# EAGLE schematic NN22_VCCS_SrcAdapter02_s00 (EAGLE 7.7.0)

## Sheet 1 of 4
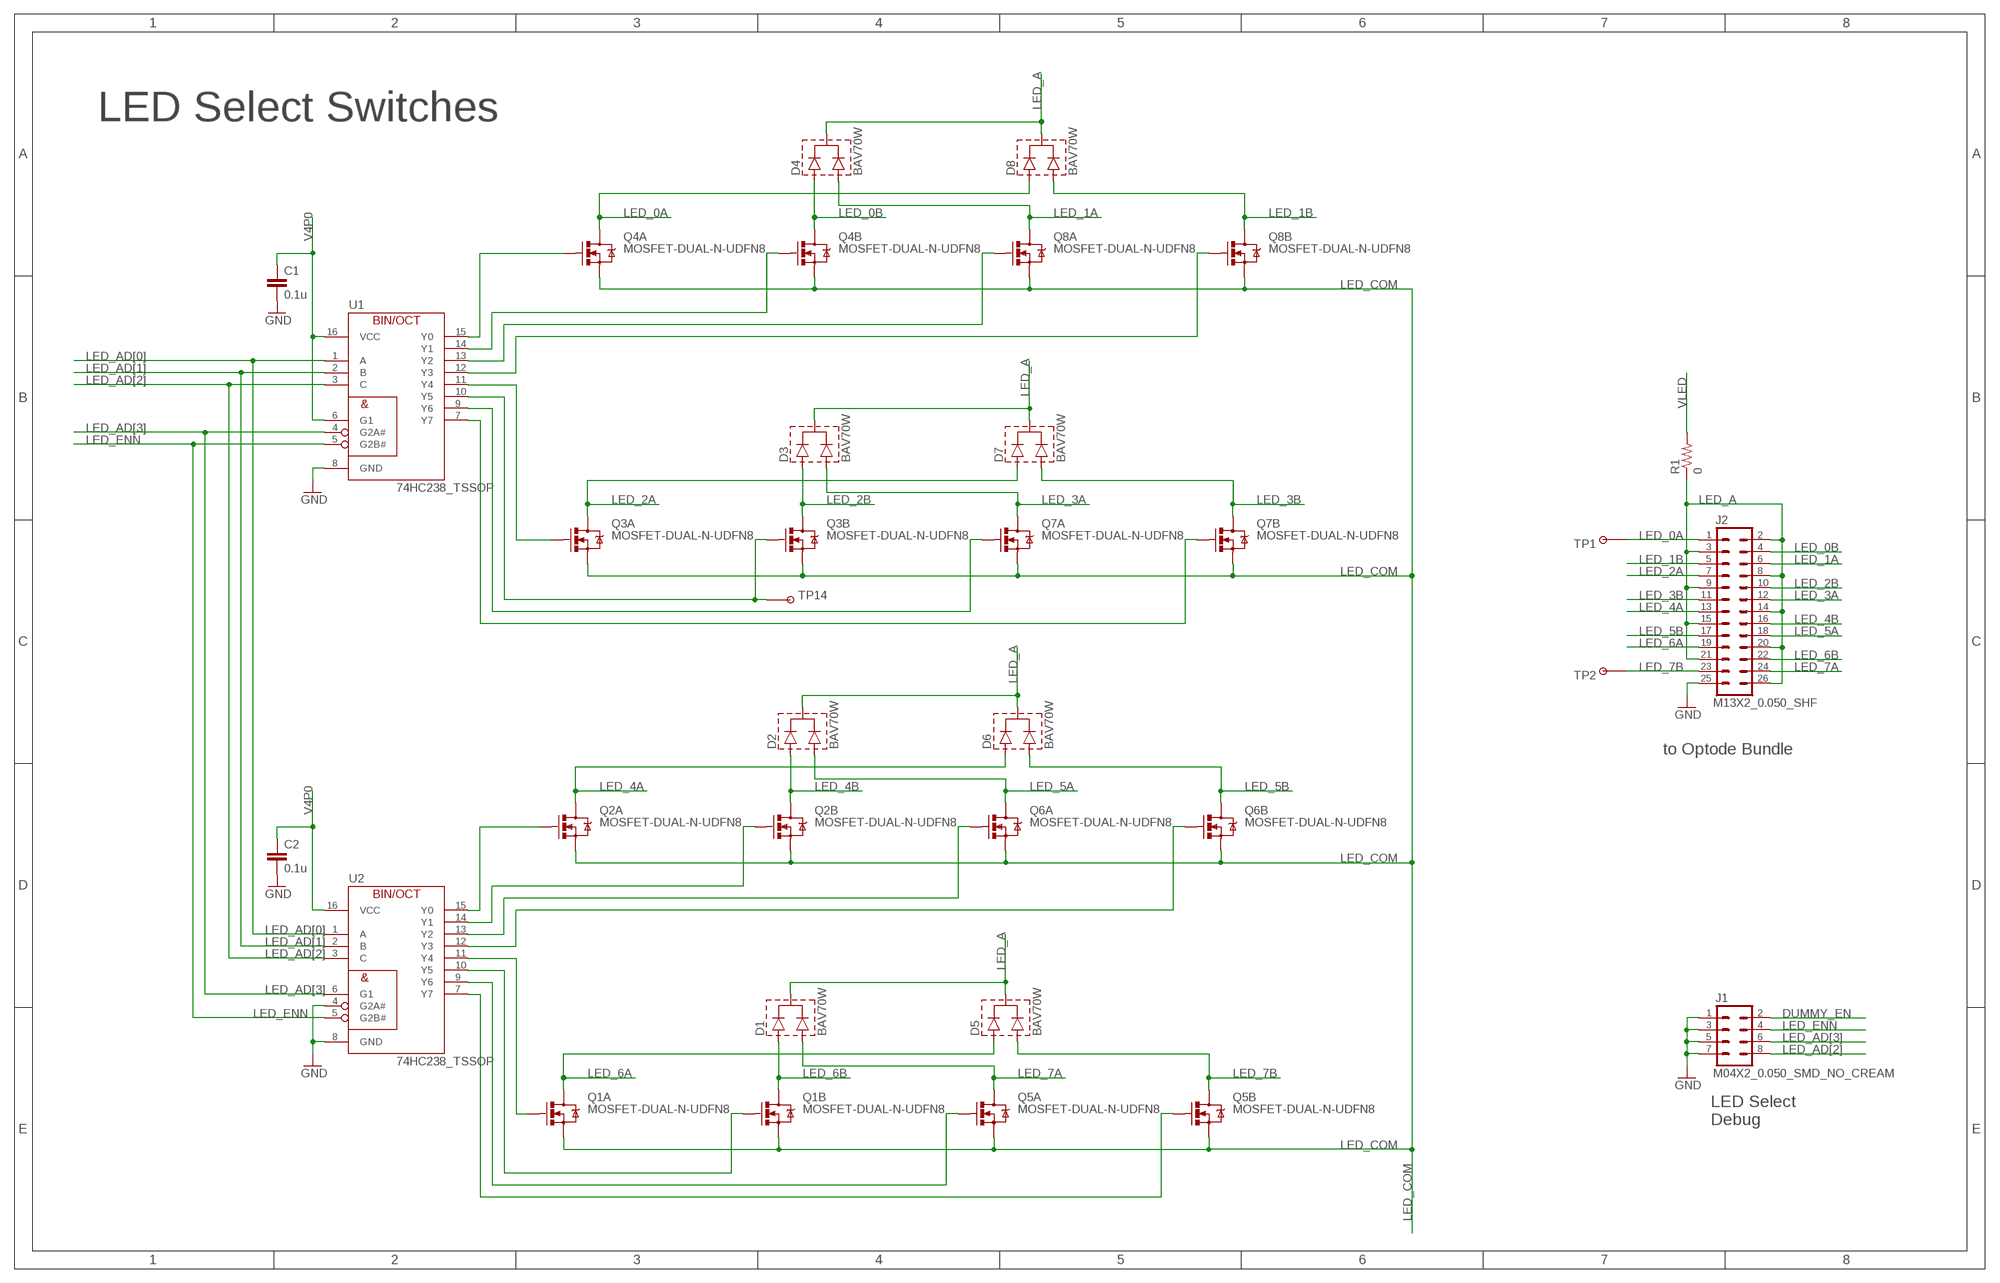
[diagram p0: schematic, sheet 1]

### Parts
C1  0.1u  CAP0402-CAP  [0402-CAP]
C2  0.1u  CAP0402-CAP  [0402-CAP]
D1  BAV70W  DIODE-COMMON_CATHODE_SOT323  [SOT323]
D2  BAV70W  DIODE-COMMON_CATHODE_SOT323  [SOT323]
D3  BAV70W  DIODE-COMMON_CATHODE_SOT323  [SOT323]
D4  BAV70W  DIODE-COMMON_CATHODE_SOT323  [SOT323]
D5  BAV70W  DIODE-COMMON_CATHODE_SOT323  [SOT323]
D6  BAV70W  DIODE-COMMON_CATHODE_SOT323  [SOT323]
D7  BAV70W  DIODE-COMMON_CATHODE_SOT323  [SOT323]
D8  BAV70W  DIODE-COMMON_CATHODE_SOT323  [SOT323]
J1  M04X2_0.050_SMD_NO_CREAM  [M04X2_0.050_SMD_NO_CREAM]
J2  M13X2_0.050_SHF  [M13X2_0.050_SHF]
Q1  MOSFET-DUAL-N-UDFN8  [UDFN8]
Q2  MOSFET-DUAL-N-UDFN8  [UDFN8]
Q3  MOSFET-DUAL-N-UDFN8  [UDFN8]
Q4  MOSFET-DUAL-N-UDFN8  [UDFN8]
Q5  MOSFET-DUAL-N-UDFN8  [UDFN8]
Q6  MOSFET-DUAL-N-UDFN8  [UDFN8]
Q7  MOSFET-DUAL-N-UDFN8  [UDFN8]
Q8  MOSFET-DUAL-N-UDFN8  [UDFN8]
R1  0  RESISTOR1206  [1206]
TP1  TESTPOINT_ROUND  [TESTPAD_ROUND]
TP2  TESTPOINT_ROUND  [TESTPAD_ROUND]
TP14  TESTPOINTPADSMALL  [TESTPAD_SMALL]
U1  74HC238_TSSOP  [TSSOP16]
U2  74HC238_TSSOP  [TSSOP16]

### Nets
DUMMY_EN: J1.2 ; also sheet 2,3
GND: C1.2 C2.2 J1.1 J1.3 J1.5 J1.7 J2.25 U1.8(GND) U2.4(G2A#) U2.8(GND) ; also sheet 2,3,4
LED_0A: D8.1(A1) J2.1 Q4.6(A:D) Q4.P1(A:D) TP1.P$1
LED_0B: D4.1(A1) J2.4 Q4.3(B:D) Q4.P2(B:D)
LED_1A: D4.2(A2) J2.6 Q8.6(A:D) Q8.P1(A:D)
LED_1B: D8.2(A2) J2.5 Q8.3(B:D) Q8.P2(B:D)
LED_2A: D7.1(A1) J2.7 Q3.6(A:D) Q3.P1(A:D)
LED_2B: D3.1(A1) J2.10 Q3.3(B:D) Q3.P2(B:D)
LED_3A: D3.2(A2) J2.12 Q7.6(A:D) Q7.P1(A:D)
LED_3B: D7.2(A2) J2.11 Q7.3(B:D) Q7.P2(B:D)
LED_4A: D6.1(A1) J2.13 Q2.6(A:D) Q2.P1(A:D)
LED_4B: D2.1(A1) J2.16 Q2.3(B:D) Q2.P2(B:D)
LED_5A: D2.2(A2) J2.18 Q6.6(A:D) Q6.P1(A:D)
LED_5B: D6.2(A2) J2.17 Q6.3(B:D) Q6.P2(B:D)
LED_6A: D5.1(A1) J2.19 Q1.6(A:D) Q1.P1(A:D)
LED_6B: D1.1(A1) J2.22 Q1.3(B:D) Q1.P2(B:D)
LED_7A: D1.2(A2) J2.24 Q5.6(A:D) Q5.P1(A:D)
LED_7B: D5.2(A2) J2.23 Q5.3(B:D) Q5.P2(B:D) TP2.P$1
LED_A: D1.3(C) D2.3(C) D3.3(C) D4.3(C) D5.3(C) D6.3(C) D7.3(C) D8.3(C) J2.2 J2.3 J2.8 J2.9 J2.14 J2.15 J2.20 J2.21 J2.26 R1.1
LED_AD[0]: U1.1(A) U2.1(A) ; also sheet 3
LED_AD[1]: U1.2(B) U2.2(B) ; also sheet 3
LED_AD[2]: J1.8 U1.3(C) U2.3(C) ; also sheet 3
LED_AD[3]: J1.6 U1.4(G2A#) U2.6(G1) ; also sheet 3
LED_COM: Q1.1(A:S) Q1.4(B:S) Q2.1(A:S) Q2.4(B:S) Q3.1(A:S) Q3.4(B:S) Q4.1(A:S) Q4.4(B:S) Q5.1(A:S) Q5.4(B:S) Q6.1(A:S) Q6.4(B:S) Q7.1(A:S) Q7.4(B:S) Q8.1(A:S) Q8.4(B:S) ; also sheet 2
LED_ENN: J1.4 U1.5(G2B#) U2.5(G2B#) ; also sheet 3
N$3: Q4.5(B:G) U1.14(Y1)
N$4: Q3.5(B:G) TP14.P$1 U1.10(Y5)
N$5: Q8.5(B:G) U1.12(Y3)
N$6: Q8.2(A:G) U1.13(Y2)
N$8: Q7.5(B:G) U1.7(Y7)
N$9: Q7.2(A:G) U1.9(Y6)
N$11: Q2.5(B:G) U2.14(Y1)
N$12: Q6.5(B:G) U2.12(Y3)
N$13: Q6.2(A:G) U2.13(Y2)
N$15: Q1.5(B:G) U2.10(Y5)
N$19: Q5.5(B:G) U2.7(Y7)
N$20: Q5.2(A:G) U2.9(Y6)
N$21: Q4.2(A:G) U1.15(Y0)
N$28: Q3.2(A:G) U1.11(Y4)
N$31: Q2.2(A:G) U2.15(Y0)
N$42: Q1.2(A:G) U2.11(Y4)
V4P0: C1.1 C2.1 U1.6(G1) U1.16(VCC) U2.16(VCC) ; also sheet 2,4
VLED: R1.2 ; also sheet 2,4

### Notes on the sheet
- LED Select Switches
- to Optode Bundle
- LED Select
  Debug

## Sheet 2 of 4
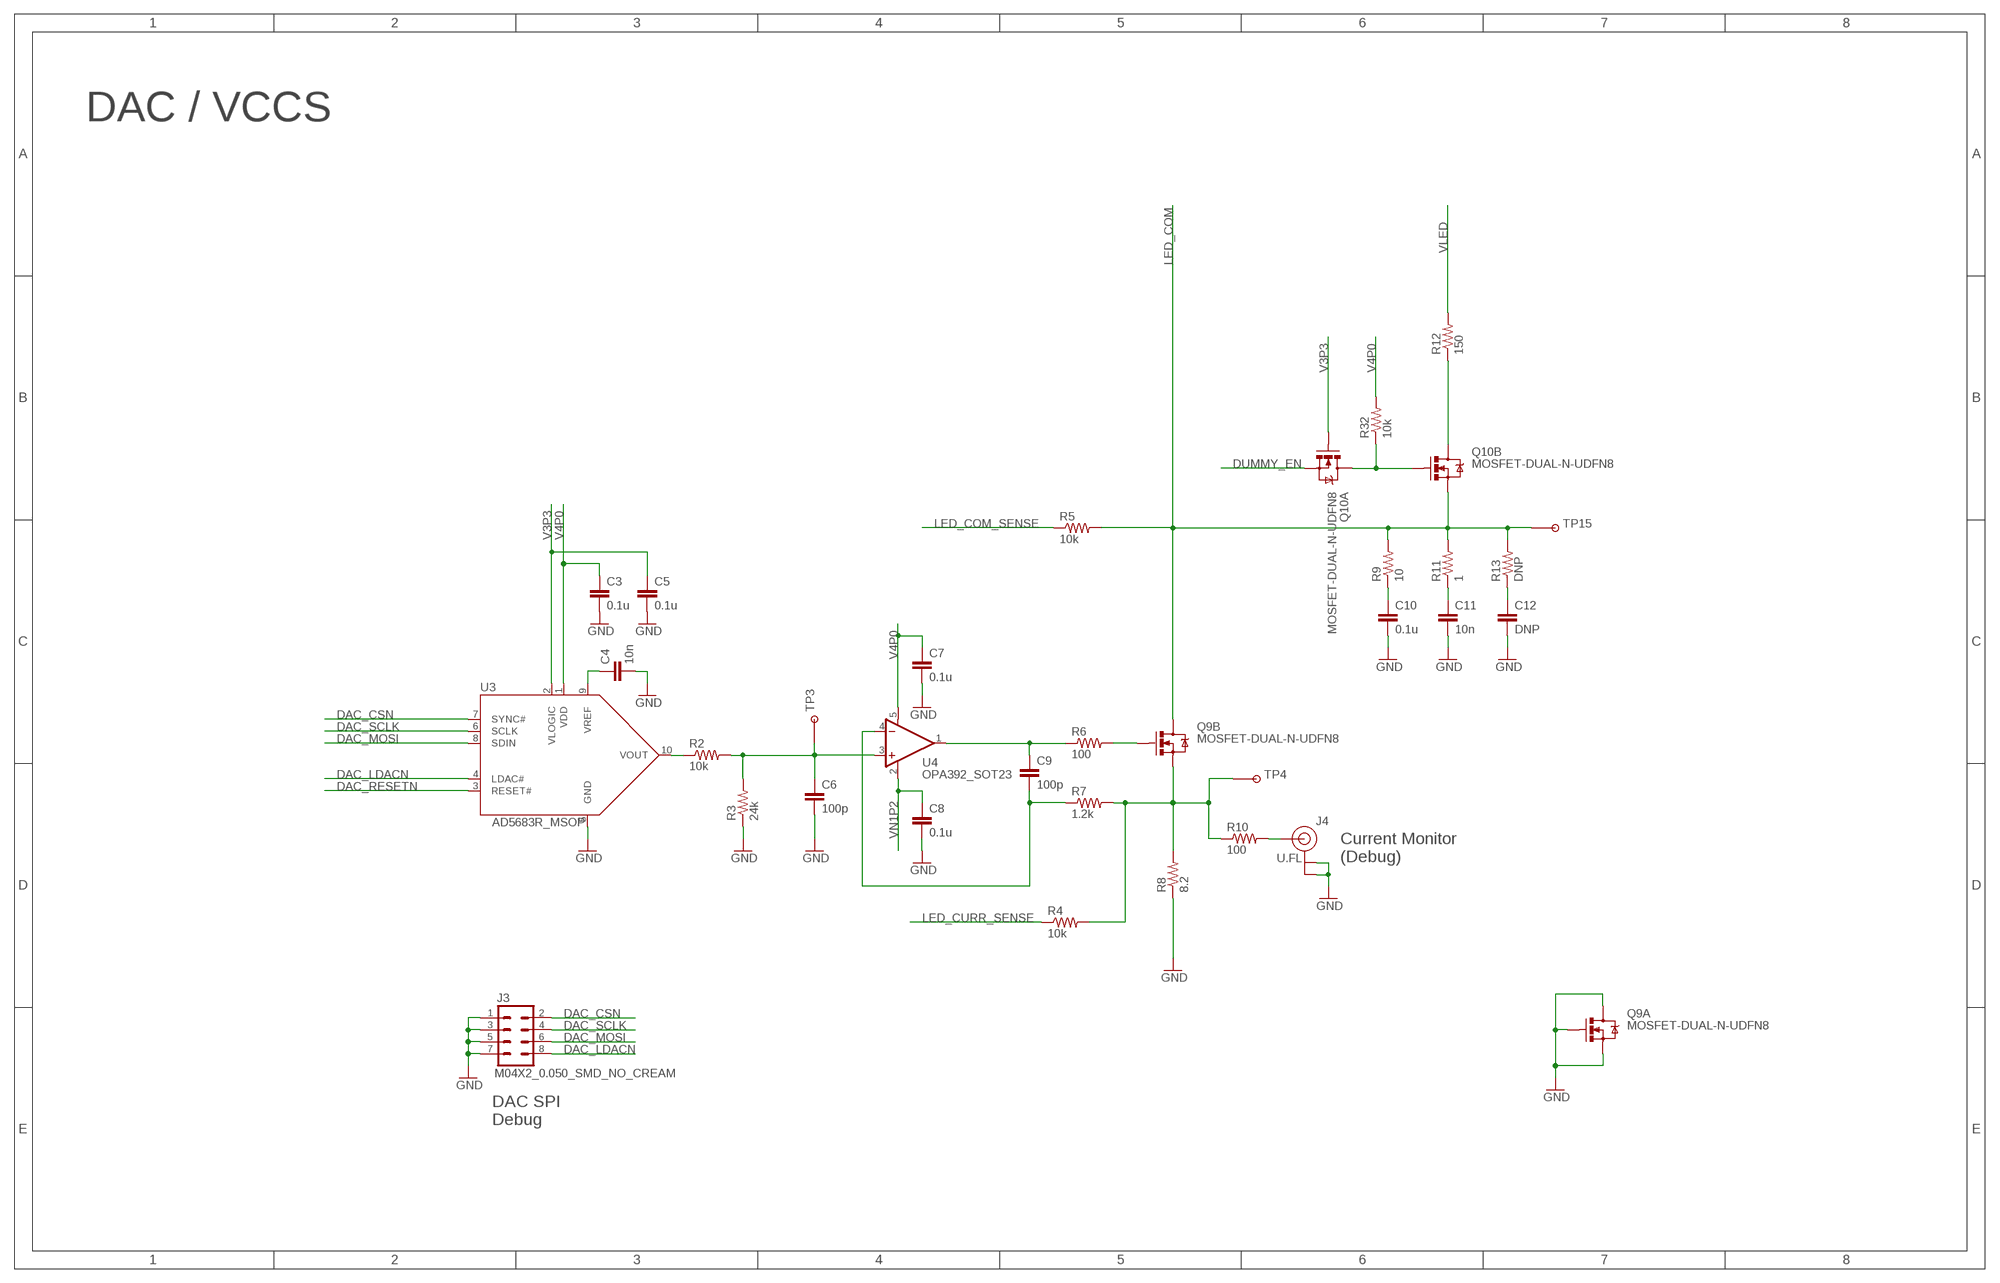
[diagram p1: schematic, sheet 2]

### Parts
C3  0.1u  CAP0402-CAP  [0402-CAP]
C4  10n  CAP0402-CAP  [0402-CAP]
C5  0.1u  CAP0402-CAP  [0402-CAP]
C6  100p  CAP0402-CAP  [0402-CAP]
C7  0.1u  CAP0402-CAP  [0402-CAP]
C8  0.1u  CAP0402-CAP  [0402-CAP]
C9  100p  CAP0402-CAP  [0402-CAP]
C10  0.1u  CAP0402-CAP  [0402-CAP]
C11  10n  CAP0402-CAP  [0402-CAP]
C12  DNP  CAP0603-CAP  [0603-CAP]
J3  M04X2_0.050_SMD_NO_CREAM  [M04X2_0.050_SMD_NO_CREAM]
J4  U.FL  [U.FL]
Q9  MOSFET-DUAL-N-UDFN8  [UDFN8]
Q10  MOSFET-DUAL-N-UDFN8  [UDFN8]
R2  10k  RESISTOR0402-RES  [0402-RES]
R3  24k  RESISTOR0402-RES  [0402-RES]
R4  10k  RESISTOR0402-RES  [0402-RES]
R5  10k  RESISTOR0402-RES  [0402-RES]
R6  100  RESISTOR0402-RES  [0402-RES]
R7  1.2k  RESISTOR0402-RES  [0402-RES]
R8  8.2  RESISTOR2512  [R2512]
R9  10  RESISTOR0603-RES  [0603-RES]
R10  100  RESISTOR0402-RES  [0402-RES]
R11  1  RESISTOR0603-RES  [0603-RES]
R12  150  RESISTOR0603-RES  [0603-RES]
R13  DNP  RESISTOR0603-RES  [0603-RES]
R32  10k  RESISTOR0402-RES  [0402-RES]
TP3  TESTPOINT_ROUND  [TESTPAD_ROUND]
TP4  TESTPOINT_ROUND  [TESTPAD_ROUND]
TP15  TESTPOINT_ROUND  [TESTPAD_ROUND]
U3  AD5683R_MSOP  [MSOP10]
U4  OPA392_SOT23  [SOT23-5]

### Nets
DAC_CSN: J3.2 U3.7(SYNC#) ; also sheet 3
DAC_LDACN: J3.8 U3.4(LDAC#) ; also sheet 3
DAC_MOSI: J3.6 U3.8(SDIN) ; also sheet 3
DAC_RESETN: U3.3(RESET#) ; also sheet 3
DAC_SCLK: J3.4 U3.6(SCLK) ; also sheet 3
DUMMY_EN: Q10.1(A:S) ; also sheet 1,3
GND: C3.2 C4.2 C5.2 C6.2 C7.2 C8.2 C10.2 C11.2 C12.2 J3.1 J3.3 J3.5 J3.7 J4.P$1(GND) J4.P$2(GND) Q9.1(A:S) Q9.2(A:G) Q9.6(A:D) Q9.P1(A:D) R3.1 R8.1 U3.5(GND) ; also sheet 1,3,4
LED_COM: Q9.3(B:D) Q9.P2(B:D) Q10.4(B:S) R5.2 R9.2 R11.2 R13.2 TP15.P$1 ; also sheet 1
LED_COM_SENSE: R5.1 ; also sheet 3
LED_CURR_SENSE: R4.1 ; also sheet 3
N$1: Q9.5(B:G) R6.2
N$2: R2.1 U3.10(VOUT)
N$7: Q10.3(B:D) Q10.P2(B:D) R12.1
N$10: C6.1 R2.2 R3.2 TP3.P$1 U4.3(+IN)
N$14: C9.1 R6.1 U4.1(OUT)
N$24: Q10.5(B:G) Q10.6(A:D) Q10.P1(A:D) R32.1
N$25: Q9.4(B:S) R4.2 R7.2 R8.2 R10.1 TP4.P$1
N$26: C9.2 R7.1 U4.4(-IN)
N$27: C4.1 U3.9(VREF)
N$32: J4.P$3(SIGNAL) R10.2
N$39: C11.1 R11.1
N$40: C10.1 R9.1
N$41: C12.1 R13.1
V3P3: C5.1 Q10.2(A:G) U3.2(VLOGIC) ; also sheet 3,4
V4P0: C3.1 C7.1 R32.2 U3.1(VDD) U4.5(V+) ; also sheet 1,4
VLED: R12.2 ; also sheet 1,4
VN1P2: C8.1 U4.2(V-) ; also sheet 4

### Notes on the sheet
- DAC / VCCS
- Current Monitor
  (Debug)
- DAC SPI
  Debug

## Sheet 3 of 4
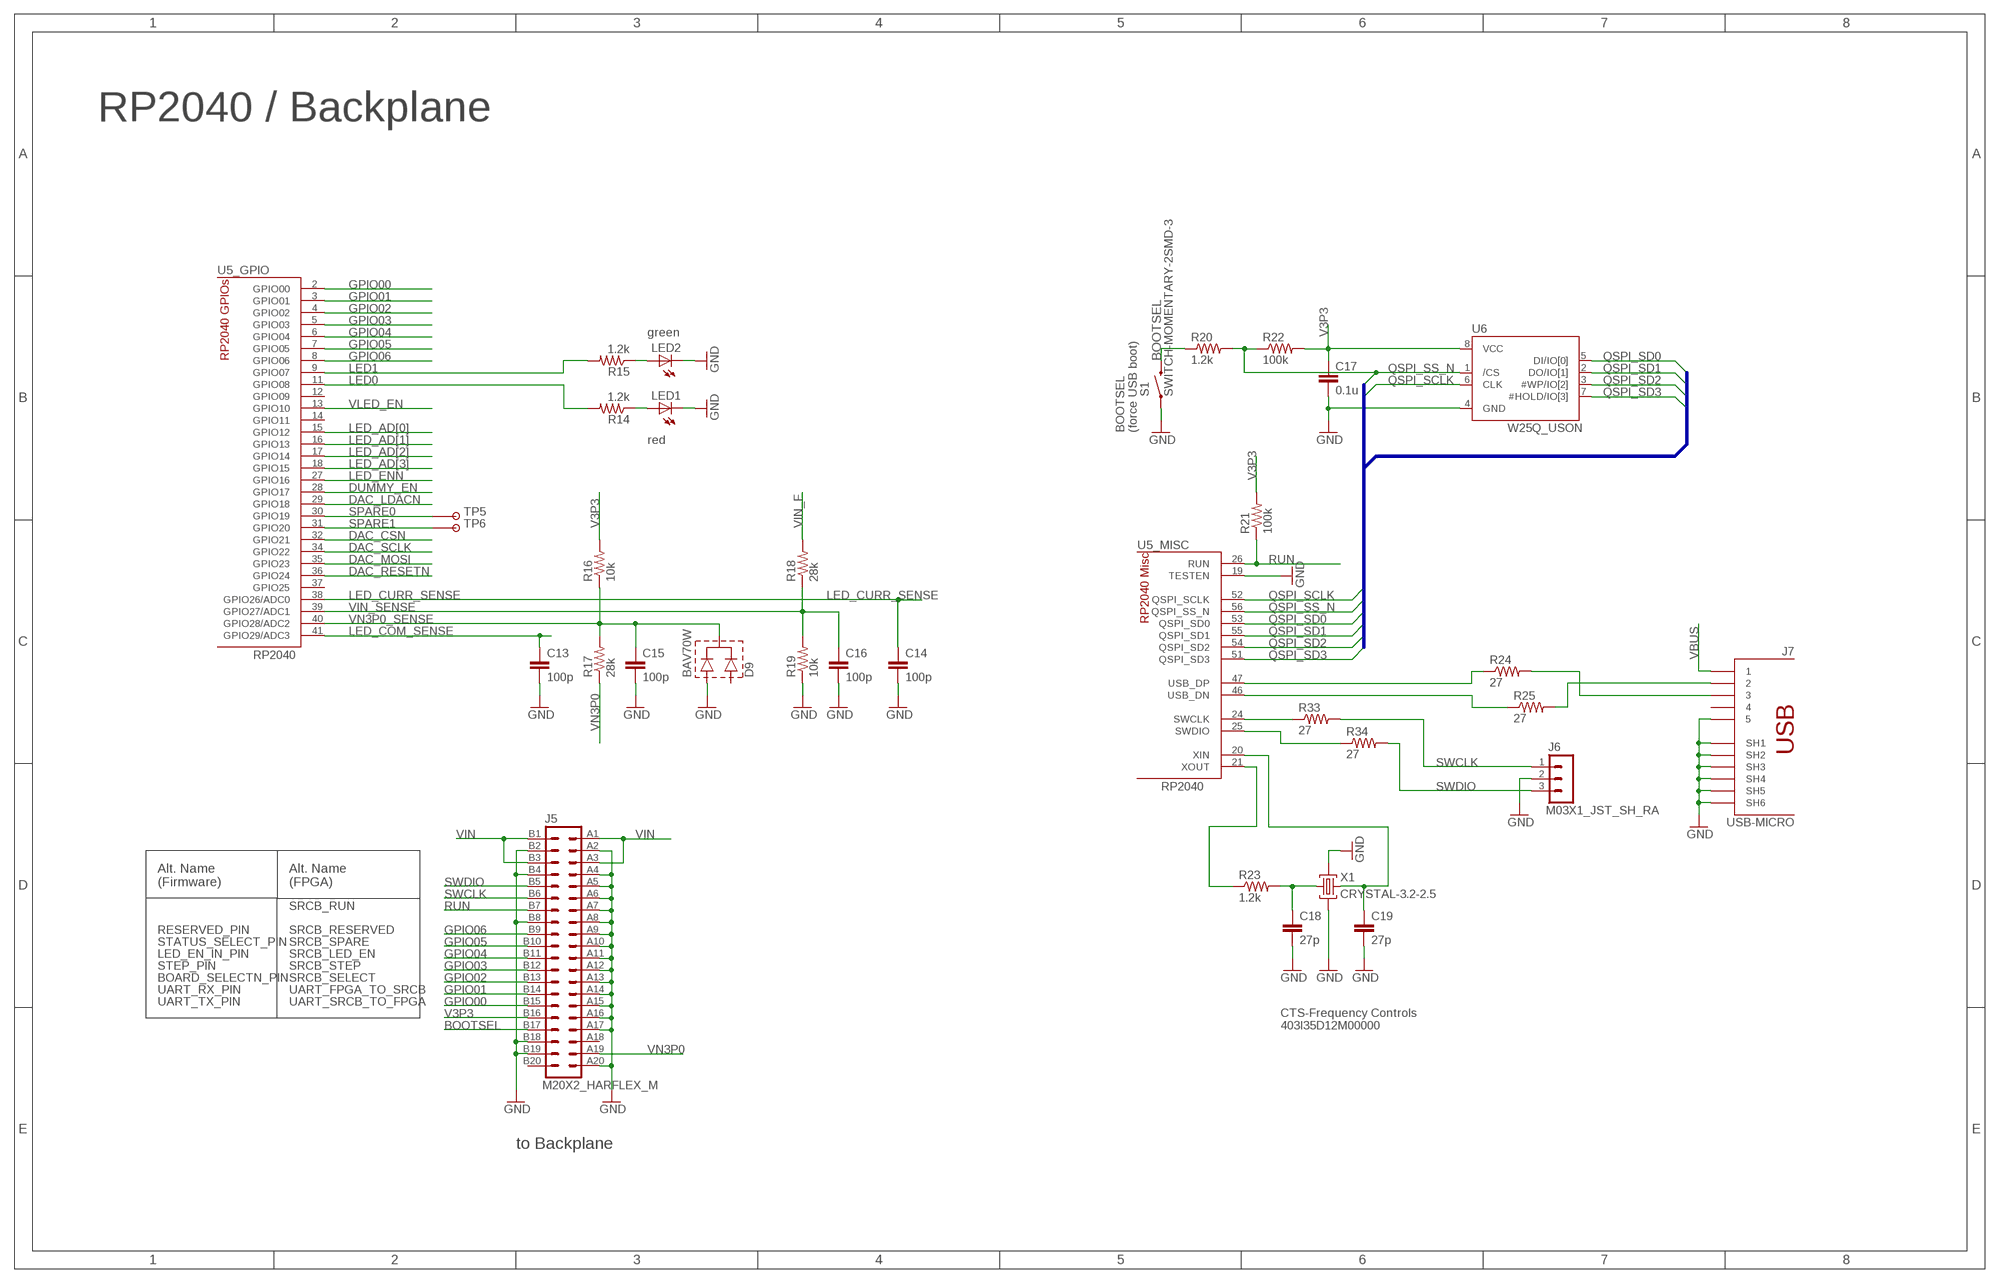
[diagram p2: schematic, sheet 3]

### Parts
C13  100p  CAP0402-CAP  [0402-CAP]
C14  100p  CAP0402-CAP  [0402-CAP]
C15  100p  CAP0402-CAP  [0402-CAP]
C16  100p  CAP0402-CAP  [0402-CAP]
C17  0.1u  CAP0402-CAP  [0402-CAP]
C18  27p  CAP0402-CAP  [0402-CAP]
C19  27p  CAP0402-CAP  [0402-CAP]
D9  BAV70W  DIODE-COMMON_CATHODE_SOT323  [SOT323]
J5  M20X2_HARFLEX_M  [M20X2_HARFLEX_M]
J6  M03X1_JST_SH_RA  [M03X1_JST_SH_SM_RA]
J7  USB-MICRO  [USB-MICRO]
LED1  LED0603  [LED-0603]
LED2  LED0603  [LED-0603]
R14  1.2k  RESISTOR0402-RES  [0402-RES]
R15  1.2k  RESISTOR0402-RES  [0402-RES]
R16  10k  RESISTOR0402-RES  [0402-RES]
R17  28k  RESISTOR0402-RES  [0402-RES]
R18  28k  RESISTOR0402-RES  [0402-RES]
R19  10k  RESISTOR0402-RES  [0402-RES]
R20  1.2k  RESISTOR0402-RES  [0402-RES]
R21  100k  RESISTOR0402-RES  [0402-RES]
R22  100k  RESISTOR0402-RES  [0402-RES]
R23  1.2k  RESISTOR0402-RES  [0402-RES]
R24  27  RESISTOR0402-RES  [0402-RES]
R25  27  RESISTOR0402-RES  [0402-RES]
R33  27  RESISTOR0402-RES  [0402-RES]
R34  27  RESISTOR0402-RES  [0402-RES]
S1  SWITCH-MOMENTARY-2SMD-3  [TACTILE_SWITCH_SMD-3]
TP5  TESTPOINTPADSMALL  [TESTPAD_SMALL]
TP6  TESTPOINTPADSMALL  [TESTPAD_SMALL]
U5  RP2040  [QFN-56_EP]
U6  W25Q_USON  [USON8L-2X3MM]
X1  CRYSTAL-3.2-2.5  [CRYSTAL-3.2-2.5]

### Nets
BOOTSEL: J5.B17 R20.1 S1.4
DAC_CSN: U5.32(_GPIO:GPIO21) ; also sheet 2
DAC_LDACN: U5.29(_GPIO:GPIO18) ; also sheet 2
DAC_MOSI: U5.35(_GPIO:GPIO23) ; also sheet 2
DAC_RESETN: U5.36(_GPIO:GPIO24) ; also sheet 2
DAC_SCLK: U5.34(_GPIO:GPIO22) ; also sheet 2
DUMMY_EN: U5.28(_GPIO:GPIO17) ; also sheet 1,2
GND: C13.2 C14.2 C15.2 C16.2 C17.2 C18.2 C19.2 D9.2(A2) J5.A2 J5.A4 J5.A5 J5.A6 J5.A7 J5.A8 J5.A9 J5.A10 J5.A11 J5.A12 J5.A13 J5.A14 J5.A15 J5.A16 J5.A17 J5.A20 J5.B2 J5.B4 J5.B8 J5.B18 J5.B19 J6.2 J7.5 J7.SH1 J7.SH2 J7.SH3 J7.SH4 J7.SH5 J7.SH6 LED1.C LED2.C R19.1 S1.1 U5.19(_MISC:TESTEN) U6.4(GND) X1.2(GND) X1.4(GND) ; also sheet 1,2,4
GPIO00: J5.B15 U5.2(_GPIO:GPIO00)
GPIO01: J5.B14 U5.3(_GPIO:GPIO01)
GPIO02: J5.B13 U5.4(_GPIO:GPIO02)
GPIO03: J5.B12 U5.5(_GPIO:GPIO03)
GPIO04: J5.B11 U5.6(_GPIO:GPIO04)
GPIO05: J5.B10 U5.7(_GPIO:GPIO05)
GPIO06: J5.B9 U5.8(_GPIO:GPIO06)
LED0: R14.2 U5.11(_GPIO:GPIO08)
LED1: R15.2 U5.9(_GPIO:GPIO07)
LED_AD[0]: U5.15(_GPIO:GPIO12) ; also sheet 1
LED_AD[1]: U5.16(_GPIO:GPIO13) ; also sheet 1
LED_AD[2]: U5.17(_GPIO:GPIO14) ; also sheet 1
LED_AD[3]: U5.18(_GPIO:GPIO15) ; also sheet 1
LED_COM_SENSE: C13.1 U5.41(_GPIO:GPIO29/ADC3) ; also sheet 2
LED_CURR_SENSE: C14.1 U5.38(_GPIO:GPIO26/ADC0) ; also sheet 2
LED_ENN: U5.27(_GPIO:GPIO16) ; also sheet 1
N$16: C19.1 U5.20(_MISC:XIN) X1.3(C2)
N$17: C18.1 R23.2 X1.1(C1)
N$18: R23.1 U5.21(_MISC:XOUT)
N$29: R24.1 U5.47(_MISC:USB_DP)
N$30: R25.1 U5.46(_MISC:USB_DN)
N$33: R34.1 U5.25(_MISC:SWDIO)
N$34: R33.1 U5.24(_MISC:SWCLK)
N$35: J7.2 R25.2
N$37: J7.3 R24.2
N$46: LED1.A R14.1
N$109: LED2.A R15.1
QSPI_SCLK: U5.52(_MISC:QSPI_SCLK) U6.6(CLK)
QSPI_SD0: U5.53(_MISC:QSPI_SD0) U6.5(DI/IO[0])
QSPI_SD1: U5.55(_MISC:QSPI_SD1) U6.2(DO/IO[1])
QSPI_SD2: U5.54(_MISC:QSPI_SD2) U6.3(#WP/IO[2])
QSPI_SD3: U5.51(_MISC:QSPI_SD3) U6.7(#HOLD/IO[3])
QSPI_SS_N: R20.2 R22.1 U5.56(_MISC:QSPI_SS_N) U6.1(/CS)
RUN: J5.B7 R21.1 U5.26(_MISC:RUN)
SPARE0: TP5.P$1 U5.30(_GPIO:GPIO19)
SPARE1: TP6.P$1 U5.31(_GPIO:GPIO20)
SWCLK: J5.B6 J6.1 R33.2
SWDIO: J5.B5 J6.3 R34.2
V3P3: C17.1 J5.B16 R16.2 R21.2 R22.2 U6.8(VCC) ; also sheet 2,4
VBUS: J7.1 ; also sheet 4
VIN: J5.A1 J5.A3 J5.B1 J5.B3 ; also sheet 4
VIN_F: R18.2 ; also sheet 4
VIN_SENSE: C16.1 R18.1 R19.2 U5.39(_GPIO:GPIO27/ADC1)
VLED_EN: U5.13(_GPIO:GPIO10) ; also sheet 4
VN3P0: J5.A19 R17.1 ; also sheet 4
VN3P0_SENSE: C15.1 D9.3(C) R16.1 R17.2 U5.40(_GPIO:GPIO28/ADC2)
Unconnected: D9.1(A1) J5.A18 J5.B20 J7.4 U5.12(_GPIO:GPIO09) U5.14(_GPIO:GPIO11) U5.37(_GPIO:GPIO25)

### Buses
QSPI_SCLK,QSPI_SS_N,QSPI_SD[0..3]

### Notes on the sheet
- RP2040 / Backplane
- green
- BOOTSEL
  (force USB boot)
- red
- Alt. Name
  (Firmware)
- Alt. Name
  (FPGA)
- SRCB_RUN
- RESERVED_PIN | SRCB_RESERVED
- STATUS_SELECT_PIN | SRCB_SPARE
- LED_EN_IN_PIN | SRCB_LED_EN
- STEP_PIN | SRCB_STEP
- BOARD_SELECTN_PIN | SRCB_SELECT
- UART_RX_PIN | UART_FPGA_TO_SRCB
- UART_TX_PIN | UART_SRCB_TO_FPGA
- CTS-Frequency Controls
  403I35D12M00000
- to Backplane

## Sheet 4 of 4
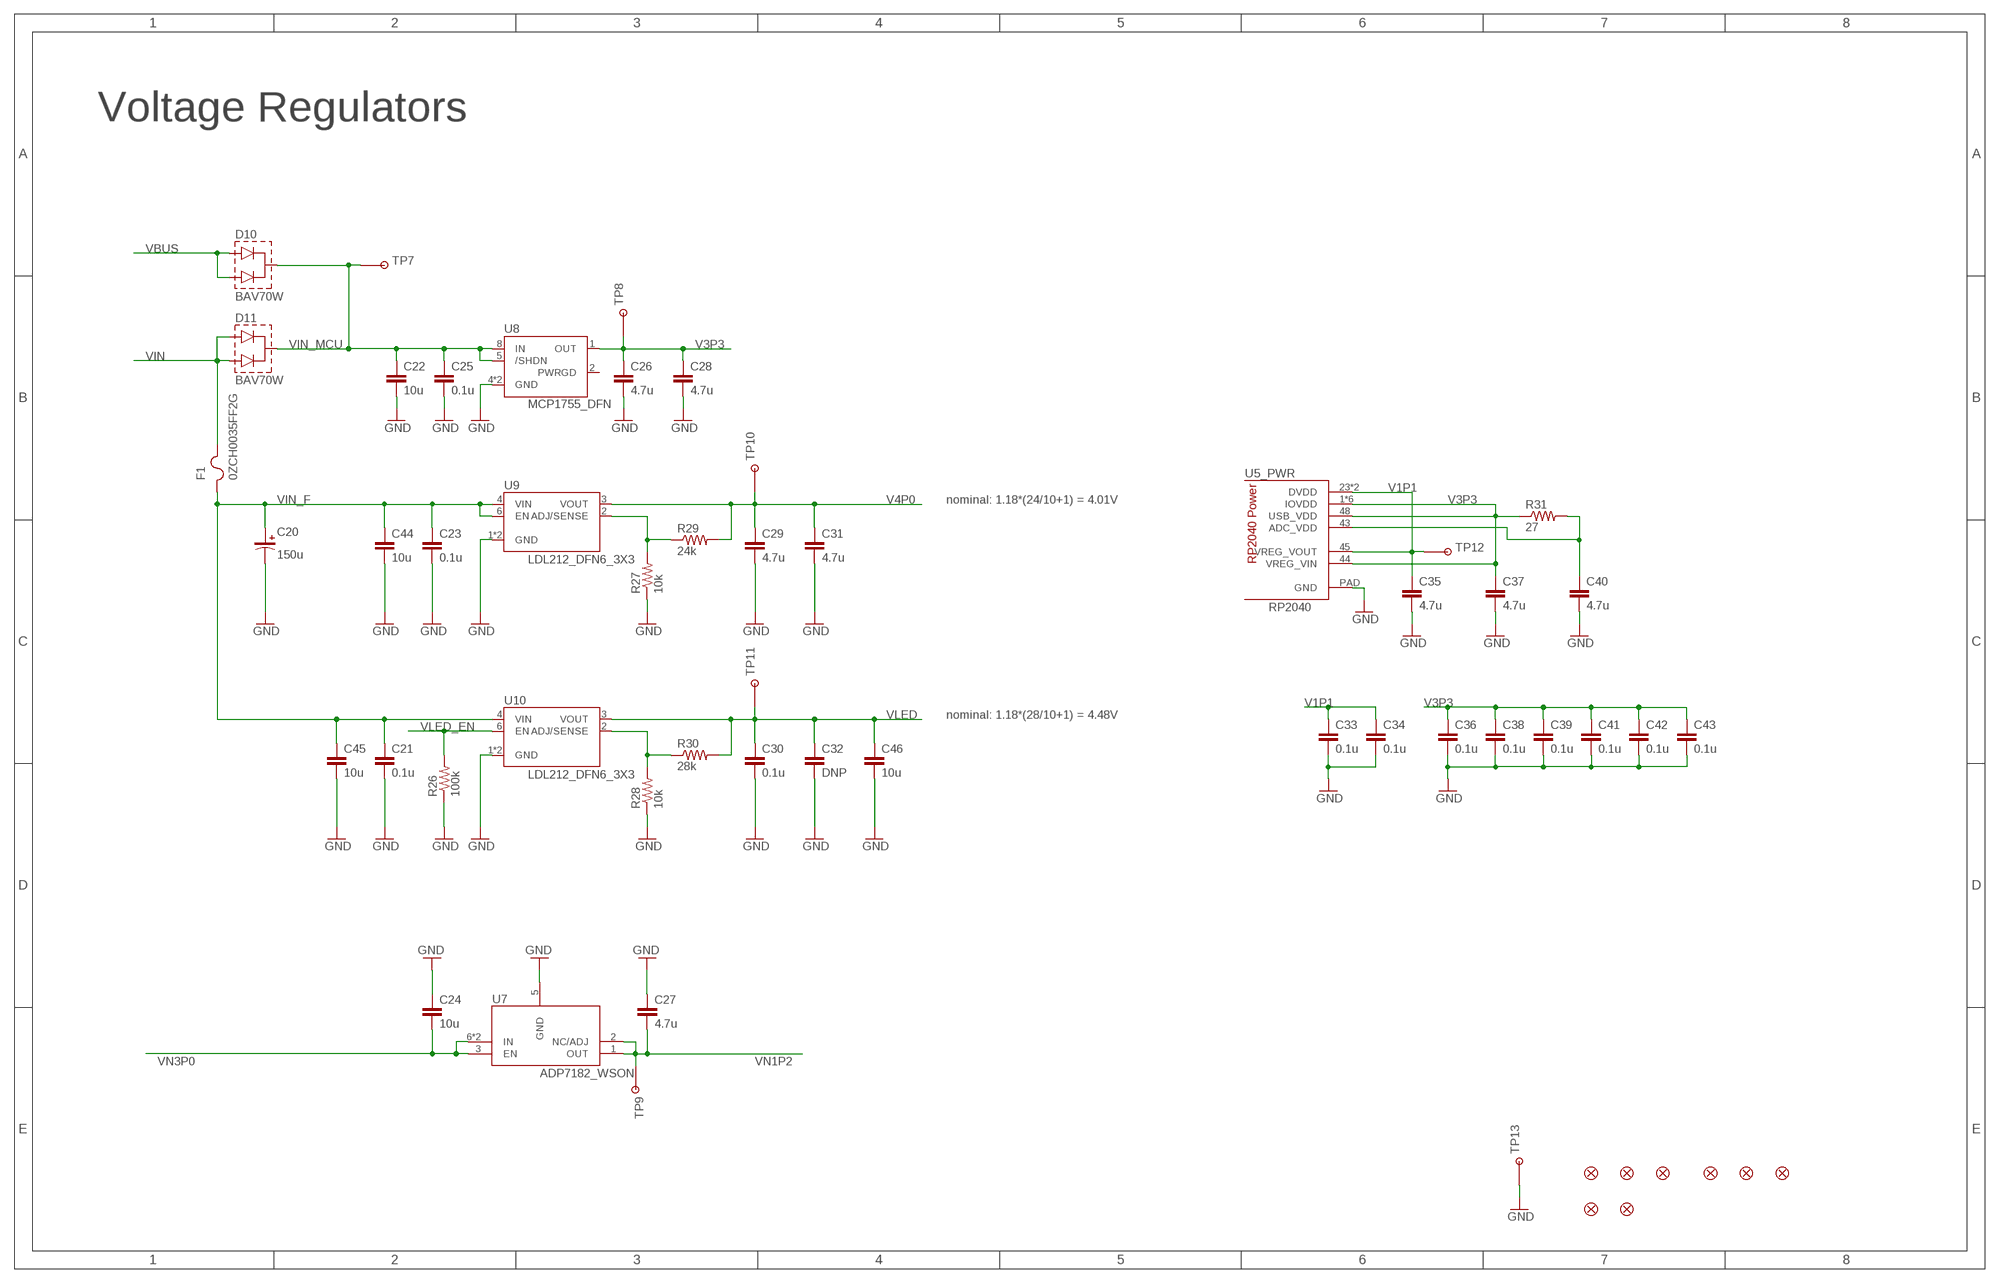
[diagram p3: schematic, sheet 4]

### Parts
C20  150u  CAP-POL2917  [2917-CAP]
C21  0.1u  CAP0402-CAP  [0402-CAP]
C22  10u  CAP0603-CAP  [0603-CAP]
C23  0.1u  CAP0402-CAP  [0402-CAP]
C24  10u  CAP0603-CAP  [0603-CAP]
C25  0.1u  CAP0402-CAP  [0402-CAP]
C26  4.7u  CAP0402-CAP  [0402-CAP]
C27  4.7u  CAP0402-CAP  [0402-CAP]
C28  4.7u  CAP0402-CAP  [0402-CAP]
C29  4.7u  CAP0402-CAP  [0402-CAP]
C30  0.1u  CAP0402-CAP  [0402-CAP]
C31  4.7u  CAP0402-CAP  [0402-CAP]
C32  DNP  CAP0402-CAP  [0402-CAP]
C33  0.1u  CAP0402-CAP  [0402-CAP]
C34  0.1u  CAP0402-CAP  [0402-CAP]
C35  4.7u  CAP0402-CAP  [0402-CAP]
C36  0.1u  CAP0402-CAP  [0402-CAP]
C37  4.7u  CAP0402-CAP  [0402-CAP]
C38  0.1u  CAP0402-CAP  [0402-CAP]
C39  0.1u  CAP0402-CAP  [0402-CAP]
C40  4.7u  CAP0402-CAP  [0402-CAP]
C41  0.1u  CAP0402-CAP  [0402-CAP]
C42  0.1u  CAP0402-CAP  [0402-CAP]
C43  0.1u  CAP0402-CAP  [0402-CAP]
C44  10u  CAP0603-CAP  [0603-CAP]
C45  10u  CAP0603-CAP  [0603-CAP]
C46  10u  CAP0603-CAP  [0603-CAP]
D10  BAV70W  DIODE-COMMON_CATHODE_SOT323  [SOT323]
D11  BAV70W  DIODE-COMMON_CATHODE_SOT323  [SOT323]
F1  0ZCH0035FF2G  FUSE_1210  [1210-FUSE]
FID1  FIDUCIALUFIDUCIAL  [MICRO-FIDUCIAL]
FID2  FIDUCIALUFIDUCIAL  [MICRO-FIDUCIAL]
FID3  FIDUCIALUFIDUCIAL  [MICRO-FIDUCIAL]
FID4  FIDUCIALUFIDUCIAL  [MICRO-FIDUCIAL]
FID5  FIDUCIALUFIDUCIAL  [MICRO-FIDUCIAL]
FID6  FIDUCIALUFIDUCIAL  [MICRO-FIDUCIAL]
FID7  FIDUCIALUFIDUCIAL  [MICRO-FIDUCIAL]
FID8  FIDUCIALUFIDUCIAL  [MICRO-FIDUCIAL]
R26  100k  RESISTOR0402-RES  [0402-RES]
R27  10k  RESISTOR0402-RES  [0402-RES]
R28  10k  RESISTOR0402-RES  [0402-RES]
R29  24k  RESISTOR0402-RES  [0402-RES]
R30  28k  RESISTOR0402-RES  [0402-RES]
R31  27  RESISTOR0402-RES  [0402-RES]
TP7  TESTPOINT_ROUND  [TESTPAD_ROUND]
TP8  TESTPOINT_ROUND  [TESTPAD_ROUND]
TP9  TESTPOINT_ROUND  [TESTPAD_ROUND]
TP10  TESTPOINT_ROUND  [TESTPAD_ROUND]
TP11  TESTPOINT_ROUND  [TESTPAD_ROUND]
TP12  TESTPOINTPADSMALL  [TESTPAD_SMALL]
TP13  TESTPOINT1X01  [1X01]
U7  ADP7182_WSON  [WSON6]
U8  MCP1755_DFN  [DFN8_2X3MM]
U9  LDL212_DFN6_3X3  [DFN6_3X3MM]
U10  LDL212_DFN6_3X3  [DFN6_3X3MM]

### Nets
GND: C20.N C21.2 C22.2 C23.2 C24.1 C25.2 C26.2 C27.1 C28.2 C29.2 C30.2 C31.2 C32.2 C33.2 C34.2 C35.2 C36.2 C37.2 C38.2 C39.2 C40.2 C41.2 C42.2 C43.2 C44.2 C45.2 C46.2 R26.1 R27.1 R28.1 TP13.1 U5.PAD(_PWR:GND) U7.5(GND) U8.4(GND) U8.P(GND) U9.1(GND) U9.PAD(GND) U10.1(GND) U10.PAD(GND) ; also sheet 1,2,3
N$22: R27.2 R29.1 U9.2(ADJ/SENSE)
N$23: R28.2 R30.1 U10.2(ADJ/SENSE)
N$43: C40.1 R31.2 U5.43(_PWR:ADC_VDD)
V1P1: C33.1 C34.1 C35.1 TP12.P$1 U5.23(_PWR:DVDD) U5.45(_PWR:VREG_VOUT) U5.50(_PWR:DVDD)
V3P3: C26.1 C28.1 C36.1 C37.1 C38.1 C39.1 C41.1 C42.1 C43.1 R31.1 TP8.P$1 U5.1(_PWR:IOVDD) U5.10(_PWR:IOVDD) U5.22(_PWR:IOVDD) U5.33(_PWR:IOVDD) U5.42(_PWR:IOVDD) U5.44(_PWR:VREG_VIN) U5.48(_PWR:USB_VDD) U5.49(_PWR:IOVDD) U8.1(OUT) ; also sheet 2,3
V4P0: C29.1 C31.1 R29.2 TP10.P$1 U9.3(VOUT) ; also sheet 1,2
VBUS: D10.1(A1) D10.2(A2) ; also sheet 3
VIN: D11.1(A1) D11.2(A2) F1.2 ; also sheet 3
VIN_F: C20.P C21.1 C23.1 C44.1 C45.1 F1.1 U9.4(VIN) U9.6(EN) U10.4(VIN) ; also sheet 3
VIN_MCU: C22.1 C25.1 D10.3(C) D11.3(C) TP7.P$1 U8.5(/SHDN) U8.8(IN)
VLED: C30.1 C32.1 C46.1 R30.2 TP11.P$1 U10.3(VOUT) ; also sheet 1,2
VLED_EN: R26.2 U10.6(EN) ; also sheet 3
VN1P2: C27.2 TP9.P$1 U7.1(OUT) U7.2(NC/ADJ) ; also sheet 2
VN3P0: C24.2 U7.3(EN) U7.6(IN) U7.PAD(IN) ; also sheet 3
Unconnected: U8.2(PWRGD)

### Notes on the sheet
- Voltage Regulators
- nominal: 1.18*(24/10+1) = 4.01V
- nominal: 1.18*(28/10+1) = 4.48V

## Library data of the parts
C1-C19 C21-C46 = MyLib:CAP: Capacitor Standard 0603 ceramic capacitor, and 0.1" leaded capacitor.
C20 = MyLib:CAP-POL
D1-D11 = MyLib:DIODE-COMMON_CATHODE: Dual Diode Common Cathode
F1 = MyLib:FUSE
FID1-FID8 = MyLib:FIDUCIAL: Fiducial Alignment Points Various fiducial points for machine vision alignment.
J1 J3 = MyLib:M04X2
J2 = MyLib:M13X2: Header 26 Positions SHF-113-01-L-D-SM SAM10712-ND
J4 = MyLib:U.FL: Hirose U.FL Coax 6GHz e.g. H9161CT-ND
J5 = MyLib:M20X2
J6 = MyLib:M03X1
J7 = MyLib:USB-MICRO: USB - micro B USB 2.0 Receptacle Connector solder retention 609-4618-2-ND
LED1 LED2 = MyLib:LED: LEDs Standard schematic elements and footprints for 5mm, 3mm, 1206, and 0603 sized LEDs. 5mm - Spark Fun Electronics SKU : COM-00529 (and others)
Q1-Q10 = MyLib:MOSFET-DUAL-N
R1-R34 = MyLib:RESISTOR: Resistor Basic schematic elements and footprints for 0603, 1206, and PTH resistors.
S1 = MyLib:SWITCH-MOMENTARY-2: Various NO switches- pushbuttons, reed, etc
TP1-TP15 = MyLib:TESTPOINT
U1 U2 = MyLib:74HC238: 3 to 8 line decoder
U3 = MyLib:AD5683R: DAC 16/14/12 Bit, SPI
U4 = MyLib:OPA392: Op-Amp 5.5V, 13MHz, Precision
U5 = MyLib:RP2040: RP2040 Raspberry Pi Pico Microcontroller
U6 = MyLib:W25Q: Flash, Serial e.g. W25Q16JVUXIQ
U7 = MyLib:ADP7182: Negative LDO
U8 = MyLib:MCP1755: LDO 16V 300 mA e.g. MCP1755-3302E/MC-ND
U9 U10 = MyLib:LDL212: Voltage regulator, linear, 20V 1.2A
X1 = MyLib:CRYSTAL-3.2-2.5: SMD Quartz Crystal e.g. CTS Series 403